# Altium schematic sheet Power.SchDoc
size A4; Revision: B.2(PCB.SCH)
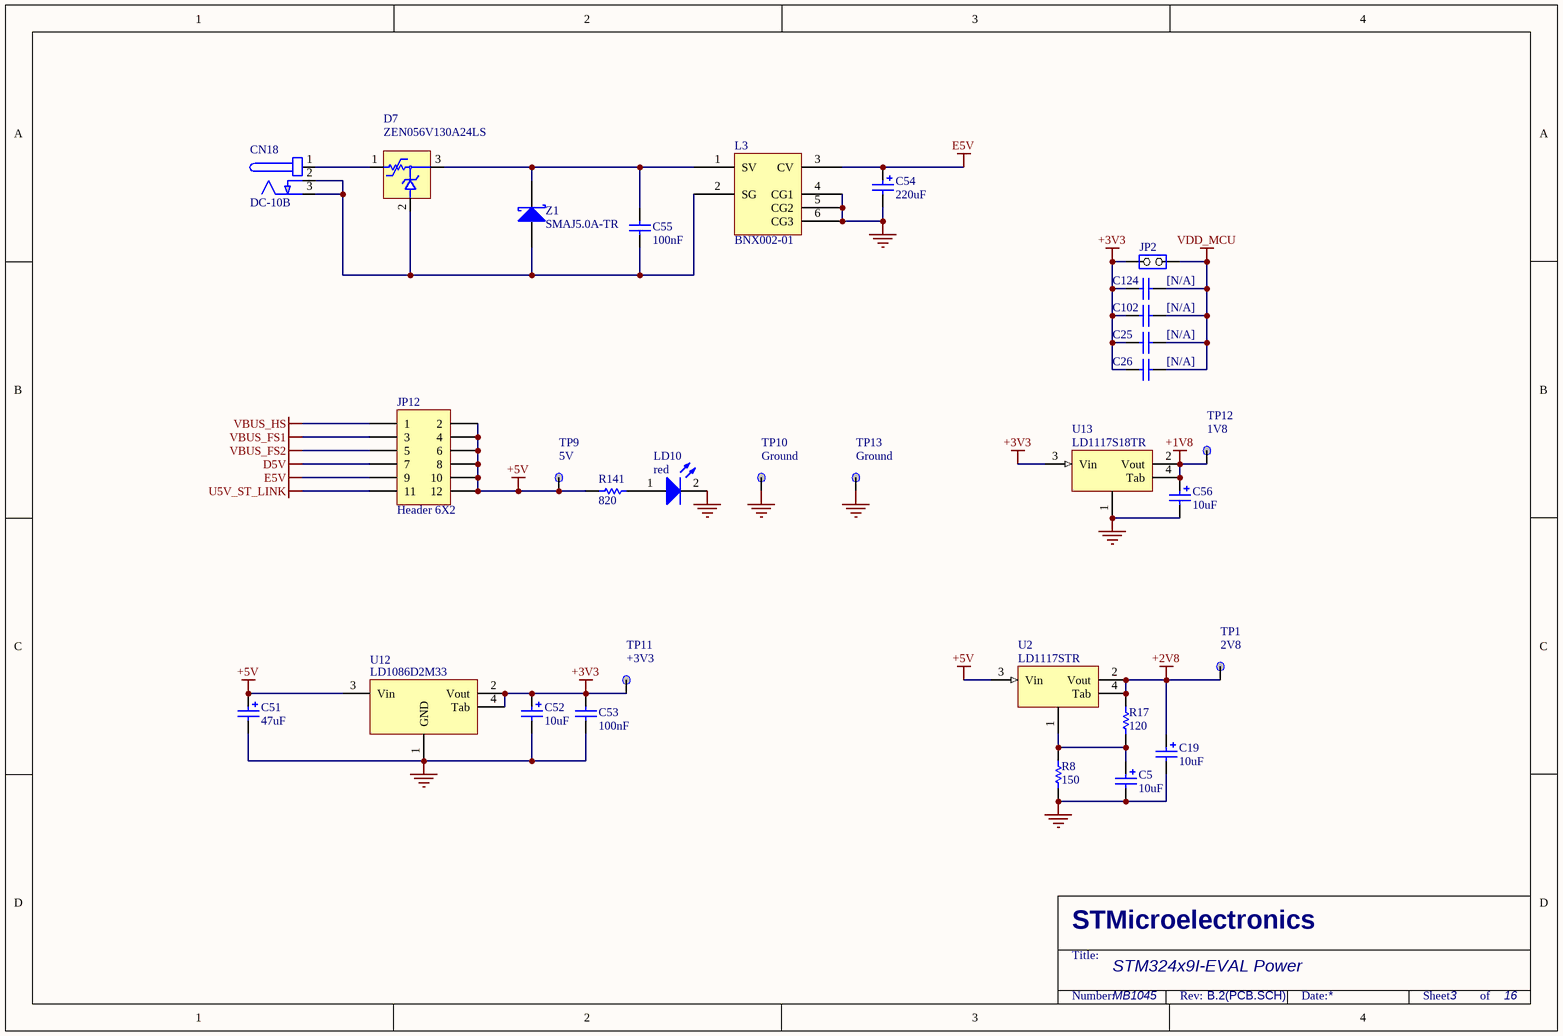
[diagram p0: Power.SchDoc]

## Parts
C5  10uF  [TAN-A]
C19  10uF  [TAN-A]
C25  [N/A]  [0603C]
C26  [N/A]  [0603C]
C51  47uF  [CAE_5R3X5R3_H5R4]
C52  10uF  [TAN-A]
C53  100nF  [0603C]
C54  220uF  [c310m-6]
C55  100nF  [0603C]
C56  10uF  [TAN-A]
C102  [N/A]  [0603C]
C124  [N/A]  [0603C]
CN18  DC-10B  [PWR_JACK_DC10]
D7  ZEN056V130A24LS  [TYCO_ZEN056V130A24LS]
JP2  (no value)  [SIP2]
JP12  Header 6X2  [HDR_2X6_2R54]
L3  BNX002-01  [BNX001]
LD10  red  [0603D]
R8  150  [0603R]
R17  120  [0603R]
R141  820  [0603R]
TP1  2V8  [TP]
TP9  5V  [TP]
TP10  Ground  [TP]
TP11  +3V3  [TP]
TP12  1V8  [TP]
TP13  Ground  [TP]
U2  LD1117STR  [SOT-223]
U12  LD1086D2M33  [TO263-3]
U13  LD1117S18TR  [SOT-223]
Z1  SMAJ5.0A-TR  [sma]

## Nets
+1V8: C56.1 TP12.1 U13.2(Vout) U13.4(Tab)
+2V8: C19.1 R17.1 TP1.1 U2.2(Vout) U2.4(Tab)
+3V3: C25.1 C26.1 C52.1 C53.1 C102.1 C124.1 JP2.1(COMMON) TP11.1 U12.2(Vout) U12.4(Tab) U13.3(Vin)
+5V: C51.1 JP12.2 JP12.4 JP12.6 JP12.8 JP12.10 JP12.12 R141.2 TP9.1 U2.3(Vin) U12.3(Vin)
D5V: JP12.7
E5V: C54.1 JP12.9 L3.3(CV)
GND: C5.2 C19.2 C51.2 C52.2 C53.2 C54.2 C56.2 L3.4(CG1) L3.5(CG2) L3.6(CG3) LD10.2(K) R8.2 TP10.1 TP13.1 U12.1(GND) U13.1
U5V_ST_LINK: JP12.11
VBUS_FS1: JP12.3
VBUS_FS2: JP12.5
VBUS_HS: JP12.1
VDD_MCU: C25.2 C26.2 C102.2 C124.2 JP2.2(NO)
NetC5_1: C5.1 R8.1 R17.2 U2.1
NetC55_1: C55.1 D7.3 L3.1(SV) Z1.2(K)
NetC55_2: C55.2 CN18.2(GND) CN18.3(GND) D7.2 L3.2(SG) Z1.1(A)
NetCN18_1: CN18.1(+) D7.1
NetLD10_1: LD10.1(A) R141.1

## Notes on the sheet
- STM324x9I-EVAL Power
- MB1045
- 3
- 16
- STMicroelectronics
- Title:
- Number:
- Rev:
- Date:
- Sheet          of

## Library data of the parts
C5 C19 C52 C56 = Cap Pol1: Polarized Capacitor (Radial); Published: 8-Jun-2000; Revision: July-2002: Re-released for DXP Platform.; Publisher: Altium Limited; Value: 10uF
C25 C26 C53 C102 C124 = Cap: Capacitor; Value: 10nF; Published: 8-Jun-2000; Revision: July-2002: Re-released for DXP Platform.; Publisher: Altium Limited
C51 = Cap Pol1: Polarized Capacitor (Radial); Value: 10uF; Published: 8-Jun-2000; Revision: July-2002: Re-released for DXP Platform.; Publisher: Altium Limited
C54 = Cap Pol1: Polarized Capacitor (Radial); Value: 47uF; Published: 8-Jun-2000; Revision: July-2002: Re-released for DXP Platform.; Publisher: Altium Limited
C55 = CAP: Capacitor; Value: 100pF; Published: 8-Jun-2000; Revision: July-2002: Re-released for DXP Platform.; Publisher: Altium Limited
CN18 = PJ202A
JP2 = JP2
JP12 = Header 6X2: Header, 6-Pin, Dual row; Revision: 17-Jul-2002: Re-released for DXP Platform.; Publisher: Altium Limited
L3 = BNX002
LD10 = LED2: Typical RED, GREEN, YELLOW, AMBER GaAs LED; Published: 8-Jun-2000; Revision: July-2002: Re-released for DXP Platform.; Publisher: Altium Limited
R8 R17 R141 = res1: Resistor; Value: 1K; Published: 8-Jun-2000; Revision: July-2002: Re-released for DXP Platform.; Publisher: Altium Limited
TP1 TP9-TP13 = TP
U2 U13 = LD1117
U12 = VOLTREG1
Z1 = D Schottky: Schottky Diode; Code - JEDEC: DO-214-AA; Published: 8-Jun-2000; Revision: July-2002: Re-released for DXP Platform.; Publisher: Altium Limited